# EAGLE design peripherals 1.0 (EAGLE 7.2.0)
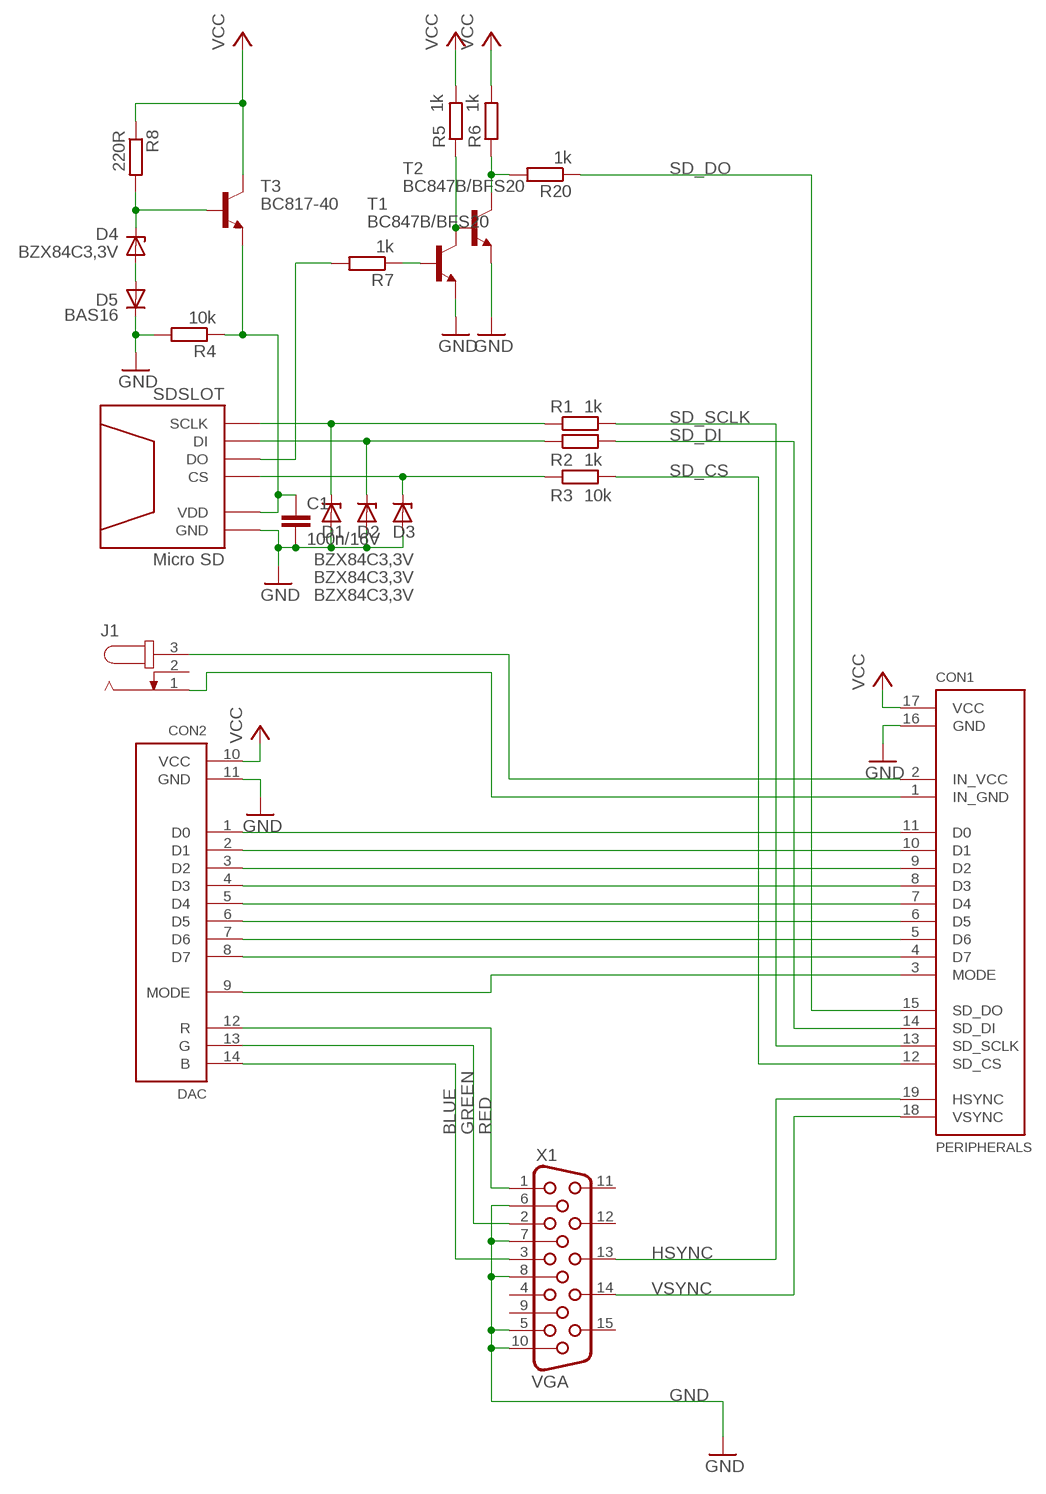
[diagram p0: schematic, sheet 1]

## Parts
C1  100n/16V  C-EUC0603  [C0603]
CON1  PERIPHERALS  [PERIPHERALS_CON]
CON2  DAC  [DAC_CON]
D1  BZX84C3,3V  ZENER-DIODESOT23  [SOT23]
D2  BZX84C3,3V  ZENER-DIODESOT23  [SOT23]
D3  BZX84C3,3V  ZENER-DIODESOT23  [SOT23]
D4  BZX84C3,3V  ZENER-DIODESOT23  [SOT23]
D5  BAS16  D-A1-C3  [SOT23]
J1  JACK-PLUG1  [SPC4078]
R1  1k  R-EU_0204/7  [0204/7]
R2  1k  R-EU_0204/7  [0204/7]
R3  10k  R-EU_0204/7  [0204/7]
R4  10k  R-EU_0204/7  [0204/7]
R5  1k  R-EU_0204/7  [0204/7]
R6  1k  R-EU_0204/7  [0204/7]
R7  1k  R-EU_0204/7  [0204/7]
R8  220R  R-EU_R0603  [R0603]
R20  1k  R-EU_0204/7  [0204/7]
SDSLOT  Micro SD  SD_SPI  [MICRO_SD_ATTEND]
T1  BC847B/BFS20  BC817-40-NPN-SOT23-BEC  [SOT23-BEC]
T2  BC847B/BFS20  BC817-40-NPN-SOT23-BEC  [SOT23-BEC]
T3  BC817-40  BC817-40-NPN-SOT23-BEC  [SOT23-BEC]
X1  VGA  HF15H  [HDF15H]

## Nets
BLUE: CON2.14(B) X1.3
GND: C1.2 CON1.16(GND) CON2.11(GND) D1.1(A) D2.1(A) D3.1(A) D5.3(C) R4.2 SDSLOT.6(GND) SDSLOT.CASE1(GND) SDSLOT.CASE2(GND) SDSLOT.CASE3(GND) SDSLOT.CASE4(GND) T1.E T2.E X1.5 X1.6 X1.7 X1.8 X1.10
GREEN: CON2.13(G) X1.2
HSYNC: CON1.19(HSYNC) X1.13
IN_GND: CON1.1(IN_GND) J1.1
IN_VCC: CON1.2(IN_VCC) J1.3
N$1: D1.3(C) R1.1 SDSLOT.5(SCLK)
N$2: D2.3(C) R2.1 SDSLOT.3(DI)
N$3: D3.3(C) R3.1 SDSLOT.2(CS)
N$4: D4.1(A) D5.1(A)
N$5: C1.1 R4.1 SDSLOT.4(VDD) T3.E
N$6: D4.3(C) R8.2 T3.B
N$7: R6.1 R20.2 T2.C
N$8: R7.2 SDSLOT.7(DO)
N$10: R5.1 T1.C T2.B
N$11: R7.1 T1.B
N$13: CON1.11(D0) CON2.1(D0)
N$14: CON1.10(D1) CON2.2(D1)
N$15: CON1.9(D2) CON2.3(D2)
N$16: CON1.8(D3) CON2.4(D3)
N$17: CON1.7(D4) CON2.5(D4)
N$18: CON1.6(D5) CON2.6(D5)
N$19: CON1.5(D6) CON2.7(D6)
N$20: CON1.4(D7) CON2.8(D7)
N$21: CON1.3(MODE) CON2.9(MODE)
RED: CON2.12(R) X1.1
SD_CS: CON1.12(SD_CS) R3.2
SD_DI: CON1.14(SD_DI) R2.2
SD_DO: CON1.15(SD_DO) R20.1
SD_SCLK: CON1.13(SD_SCLK) R1.2
VCC: CON1.17(VCC) CON2.10(VCC) R5.2 R6.2 R8.1 T3.C
VSYNC: CON1.18(VSYNC) X1.14
Unconnected: J1.2 X1.4 X1.9 X1.11 X1.12 X1.15

## Library data of the parts
C1 = rcl:C-EU: CAPACITOR, European symbol
CON1 = peripherals connector:PERIPHERALS
CON2 = DAC connector:DAC
D1-D4 = diode:ZENER-DIODE: Z-Diode
D5 = semicon-smd-ipc:D-: DIODE unfilled
J1 = con-jack:JACK-PLUG: DC POWER JACK Power Jack, DC, Right Angle, Through Hole, Rated 5A at 16VDC, PC Terminals Distributor: Farnell (www.Farnell.de) Drawing: 84N1161.pdf / 84N1162.pdf Manufacturer: SPC Technology (www.spctechnology.com) Type: SPC4077 / SPC 4078; OC_FARNELL: unknown; OC_NEWARK: unknown
R1-R8 R20 = rcl:R-EU_: RESISTOR, European symbol
SDSLOT = SD card:SD_SPI
T1-T3 = transistor:*-NPN-: NPN Transistror BF959 corrected 2008.03.06
X1 = con-subd:HF15: SUB-D; OC_FARNELL: unknown; OC_NEWARK: unknown

## Board
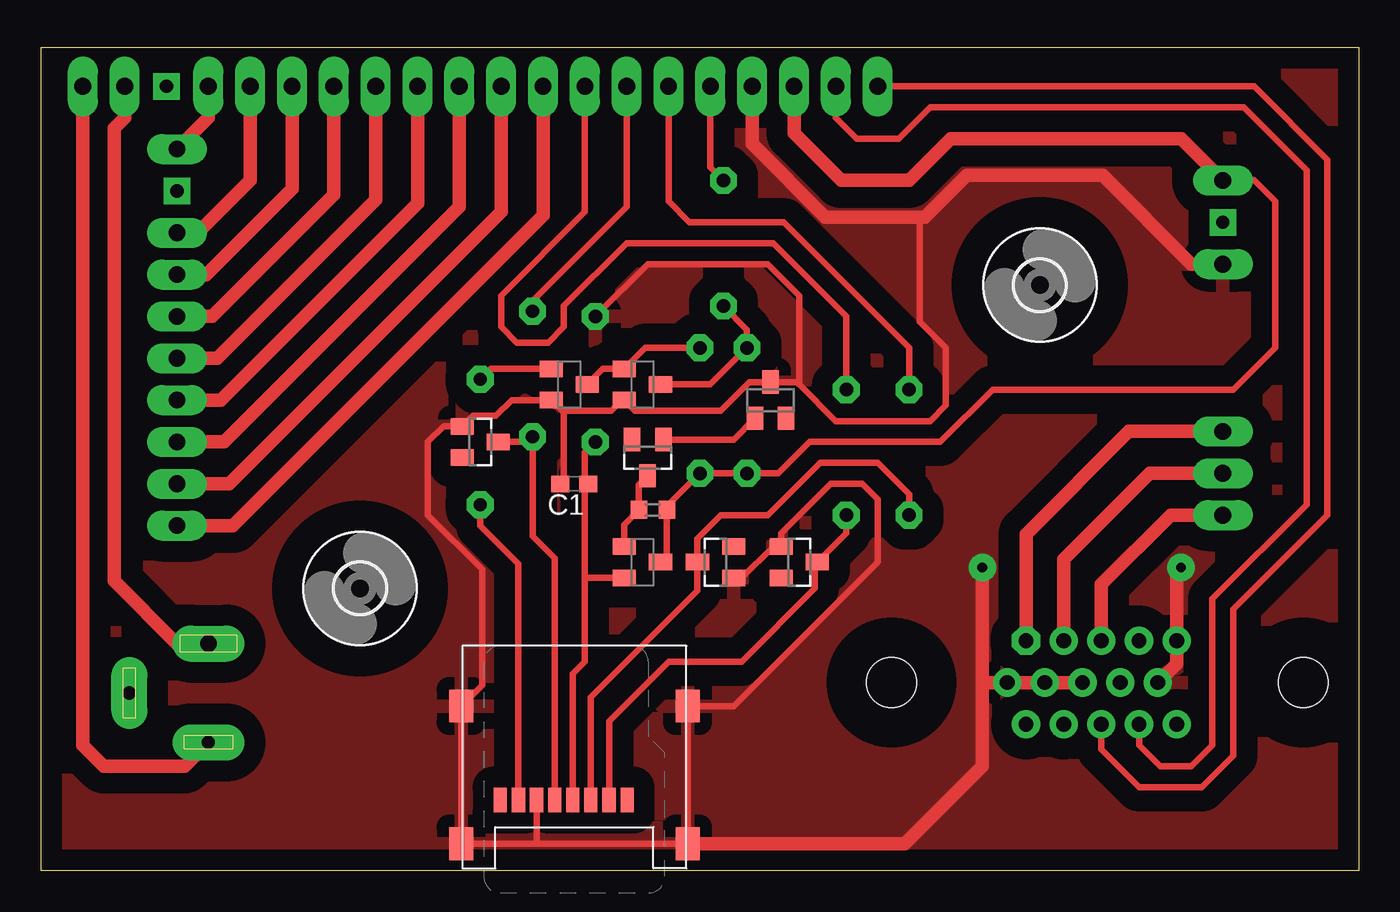
[diagram p1: board, top side]
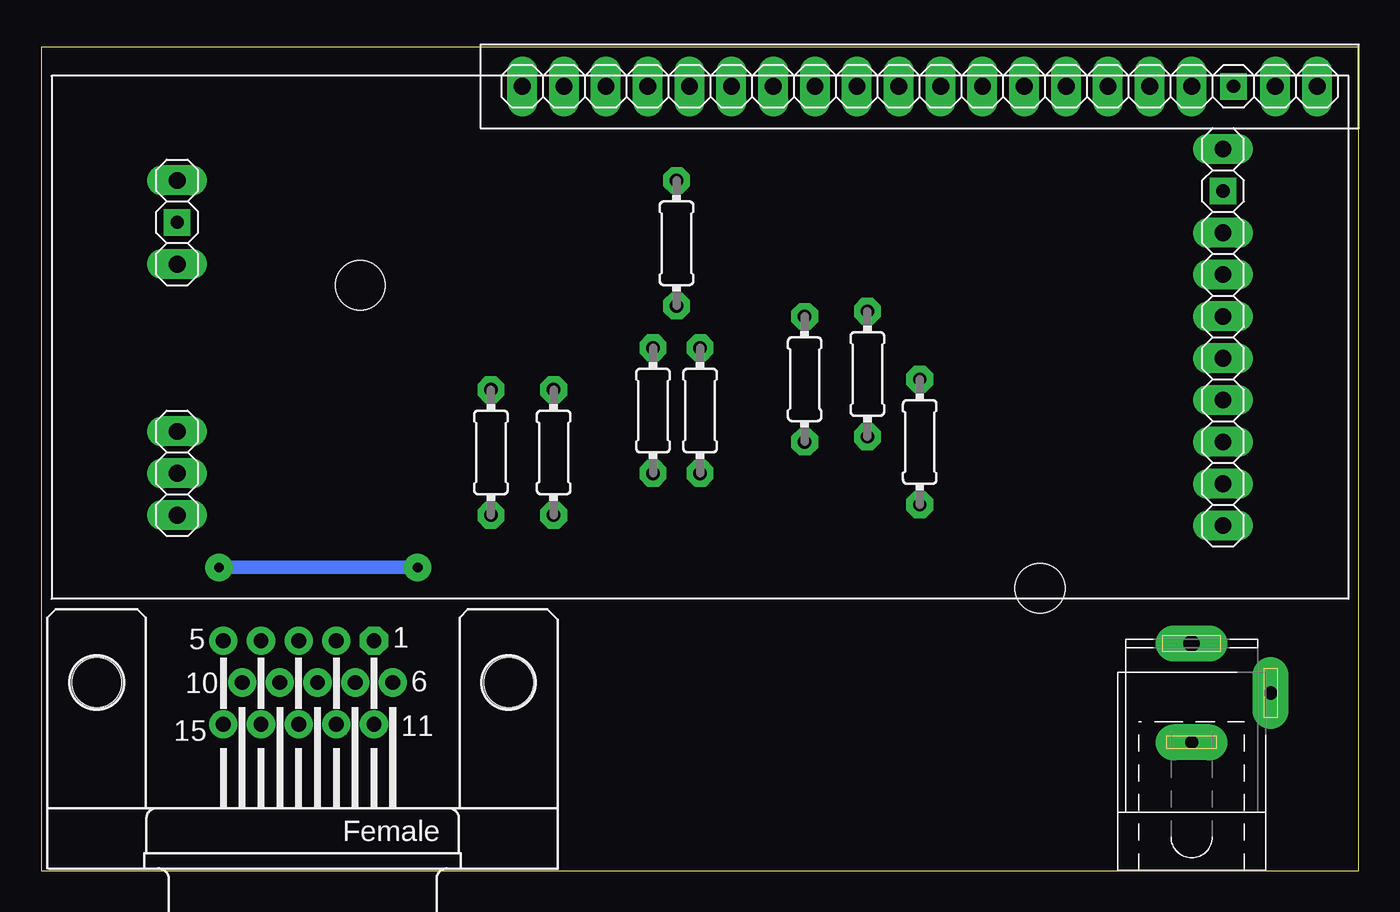
[diagram p2: board, bottom side, seen from below]

Size 80 x 50 mm. Coordinates in mm from the lower left corner, seen from the top.
Outline: 80,0 0,0 0,50 80,50 80,0
Copper layers (1*16): Top 0.035mm / dielectric 1.5mm / Bottom 0.035mm
Design rules "Aroidzap_DesignRules": minimum track width 16mil, minimum drill 0.6mm, track to track 20mil, track to pad 20mil, pad to pad 20mil, via to via 20mil, smd to smd 16mil, copper to edge 20mil, drill to drill 40mil, minimum pad ring 16mil, minimum via ring 10mil, stop-mask expansion 4mil, vias tented up to drill 0mil, thermal gap 30mil

### Footprints (pad centres in the part's own frame; a part is rotated, then mirrored left to right if it is on the bottom)
C0603 = smd 1.1 x 1: 1 -0.85,0; 2 0.85,0
PERIPHERALS_CON = drill 1.016 long: 1 24.13,0; 2 21.59,0; 3 16.51,0; 4 13.97,0; 5 11.43,0; 6 8.89,0; 7 6.35,0; 8 3.81,0; 9 1.27,0; 10 -1.27,0; 11 -3.81,0; 12 -6.35,0; 13 -8.89,0; 14 -11.43,0; 15 -13.97,0; 16 -16.51,0; 17 -19.05,0; 18 -21.59,0; 19 -24.13,0 | drill 0.8 square: NC 19.05,0
DAC_CON = drill 1.016 long: 1 31.75,-11.43; 2 31.75,-8.89; 3 31.75,-6.35; 4 31.75,-3.81; 5 31.75,-1.27; 6 31.75,1.27; 7 31.75,3.81; 8 31.75,6.35; 9 31.75,11.43; 10 -31.75,9.525; 11 -31.75,4.445; 12 -31.75,-5.715; 13 -31.75,-8.255; 14 -31.75,-10.795 | drill 0.8 square: NC1 31.75,8.89; NC2 -31.75,6.985
SOT23 = smd 1 x 1.4: 1 -0.95,-1.1; 2 0.95,-1.1; 3 0,1.1
SPC4078 = drill 0.8 pad 2.184 long: 1 -3,0; 2 0,-4.8 | drill 1 pad 2.184 long: 3 3,0
0204/7 = drill 0.813 octagon: 1 -3.81,0; 2 3.81,0
R0603 = smd 1 x 1.1: 1 -0.85,0; 2 0.85,0
MICRO_SD_ATTEND = smd 0.8 x 1.5: 1 -3.2,9.35; 2 -2.1,9.35; 3 -1,9.35; 4 0.1,9.35; 5 1.2,9.35; 6 2.3,9.35; 7 3.4,9.35; 8 4.5,9.35 | smd 1.45 x 2: CASE1 -6.875,12; CASE2 6.875,12; CASE3 -6.875,3.65; CASE4 6.875,3.65
SOT23-BEC = smd 1 x 1.4: B -0.95,-1.1; C 0,1.1; E 0.95,-1.1
3,0 = hole 3: 0,0
HDF15H = drill 0.9 octagon: 1 4.329,2.54 | drill 0.9: 2 2.043,2.54; 3 -0.243,2.54; 4 -2.529,2.54; 5 -4.815,2.54; 6 5.472,0; 7 3.186,0; 8 0.9,0; 9 -1.386,0; 10 -3.672,0; 11 4.329,-2.54; 12 2.043,-2.54; 13 -0.243,-2.54; 14 -2.529,-2.54; 15 -4.815,-2.54 | hole 3: -12.5,0; 12.5,0

### Placement (x,y rotation side)
C1  32.38,23.5 180 top
CON1  26.66,47.62 0 bottom
CON2  40,32.38 0 bottom
D1  26.66,26.04 270 top
D2  40.95,18.73 90 top
D3  46.03,18.73 270 top
D4  36.82,25.08 180 top
D5  44.28,28.57 0 top
J1  10.15,10.79 90 bottom
R1  29.83,30.16 90 bottom
R2  52.7,25.4 90 bottom
R3  48.89,25.4 90 bottom
R4  33.65,29.84 90 bottom
R5  40,27.94 270 bottom
R6  42.85,27.94 270 bottom
R7  26.66,26.04 270 bottom
R8  37.14,21.91 180 top
R20  41.42,38.1 270 bottom
SDSLOT  32.38,13.65 180 top
T1  32.06,29.53 270 top
T2  36.5,29.53 270 top
T3  36.5,18.73 270 top
U$1  [3,0]  19.36,17.14 0 top
U$2  [3,0]  60.63,35.56 0 top
X1  64.12,11.43 0 bottom

### Tracks (layer width: path | path; a pad name or v marks a point on that pad's centre or on a via)
BLUE
  Top 0.813: X1.3 64.37,17.39 68.57,21.59 CON2.14
GND  (via drill 0.6 pad 1.68)
  Top 0.406: 30.07,1.65 SDSLOT.CASE2 SDSLOT.CASE4 26.77,11.27 26.77,18.3 23.48,21.59 23.48,26.04 24.43,26.98 D1.1 26.2,27.62 27.61,27.62 28.57,28.58 T1.E 31.59,27.94 31.74,27.94 | 30.07,1.65 SDSLOT.CASE1 SDSLOT.CASE3 42.06,10 50.79,18.73 50.79,22.54 49.84,23.5 47.93,23.5 44.93,20.49 D3.1 | SDSLOT.6 30.07,1.65 | D2.1 42.54,17.78 44.44,19.68 D3.1 | D3.1 | T2.E 36.04,27.94 41.27,27.94 43,29.68 D5.3 45.88,29.68 46.03,29.53 | T2.E | T2.E 35.23,28.58 34.6,27.94 31.74,27.94 | R4.2 36.82,36.83 44.12,36.83 46.03,34.92 46.03,29.53 | 46.03,29.53 48.25,27.3 53.97,27.3 54.92,28.26 54.92,31.75 53.33,33.34 53.33,39.69 | C1.2 31.74,23.5 31.74,27.94
  Top 0.813: X1.8 X1.7 X1.6 57.14,11.43 | X1.10 68.94,12.57 X1.5 68.94,18.15 v69.2,18.41 | v57.14,18.41 57.14,11.43 | 57.14,11.43 57.14,6.35 52.44,1.65 SDSLOT.CASE1 | CON1.16 43.17,44.13 47.62,39.69 53.33,39.69 53.65,39.69 56.19,42.23 64.44,42.23 69.84,36.83 CON2.11
  Bottom 0.813: v57.14,18.41 v69.2,18.41
  pour Top (isolate 1.27): -0.01,0 80.32,0 80.32,50.16 -0.01,50.16
GREEN
  Top 0.813: X1.2 62.08,18.91 67.3,24.13 CON2.13
HSYNC
  Top 0.406: X1.13 64.37,7.38 66.66,5.08 70.47,5.08 72.38,6.99 72.38,15.88 78.09,21.59 78.09,43.18 73.65,47.62 CON1.19
IN_GND
  Top 0.813: J1.1 8.71,6.35 3.8,6.35 2.53,7.62 CON1.1
IN_VCC
  Top 0.813: CON1.2 5.07,45.72 4.44,45.09 4.44,17.61 8.25,13.79 J1.3
N$1
  Top 0.406: SDSLOT.5 31.17,18.98 29.83,20.32 29.83,26.04 | 29.83,26.04 R1.1 | D1.3 29.83,26.04
N$2
  Top 0.406: SDSLOT.3 33.38,10.53 39.85,17 D2.3 39.85,20.17 41.27,21.59 44.12,21.59 47.3,24.77 50.79,24.77 52.7,22.86 R2.1
N$3
  Top 0.406: SDSLOT.2 34.48,9.09 38.09,12.7 42.54,12.7 46.98,17.14 46.98,18.59 D3.3 48.89,20.49 R3.1
N$4
  Top 0.406: D4.1 42.04,26.18 D5.1
N$5
  Top 0.406: 33.01,17.78 33.01,12.7 32.27,11.96 SDSLOT.4 | T3.E 33.01,17.78 | R4.1 33.01,25.4 33.01,24.13 33.01,23.5 | 33.01,23.5 33.01,17.78 | C1.1 33.01,23.5
N$6
  Top 0.406: D4.3 36.29,23.45 R8.2 35.4,21.02 T3.B
N$7
  Top 0.406: T2.C 40.63,29.53 R6.1 42.85,32.86 R20.2
N$8
  Top 0.406: SDSLOT.7 28.97,18.64 26.66,20.95 R7.2
N$10
  Top 0.406: R5.1 36.68,31.75 T2.B 34.11,30.48 T1.C
N$11
  Top 0.406: T1.B 27.29,30.48 R7.1
N$13
  Top 0.813: CON1.11 30.47,39.79 11.64,20.95 CON2.1
N$14
  Top 0.813: CON2.2 11.42,23.5 27.93,40.01 CON1.10
N$15
  Top 0.813: CON2.3 11.12,26.04 25.39,40.3 CON1.9
N$16
  Top 0.813: CON2.4 10.91,28.57 22.85,40.52 CON1.8
N$17
  Top 0.813: CON2.5 10.7,31.11 20.31,40.73 CON1.7
N$18
  Top 0.813: CON2.6 10.38,33.66 17.77,41.04 CON1.6
N$19
  Top 0.813: CON2.7 10.02,36.2 15.23,41.41 CON1.5
N$20
  Top 0.813: CON2.8 9.52,38.73 12.69,41.91 CON1.4
N$21
  Top 0.813: CON2.9 10.15,45.72 CON1.3
RED
  Top 0.813: X1.1 59.8,20.44 66.03,26.67 CON2.12
SD_CS
  Top 0.406: CON1.12 33.01,40.01 27.93,34.92 27.93,33.02 28.88,32.07 30.79,32.07 31.74,33.02 31.74,34.29 35.55,38.1 44.44,38.1 48.89,33.66 R3.2
SD_DI
  Top 0.406: CON1.14 38.09,40.64 39.36,39.37 45.08,39.37 52.7,31.75 R2.2
SD_DO
  Top 0.406: CON1.15 40.63,42.7 R20.1
SD_SCLK
  Top 0.406: R1.2 29.83,34.61 35.55,40.32 CON1.13
VCC
  Top 0.406: T3.C 37.99,19.12 R8.1 37.99,22.12 R5.2 R6.2 44.76,24.13 46.66,26.04 54.6,26.04 57.77,29.21 72.38,29.21 74.92,31.75 74.92,40.64 73.65,41.91 CON2.10
  Top 0.813: CON1.17 45.71,44.77 48.57,41.91 52.7,41.91 55.23,44.45 69.2,44.45 CON2.10
VSYNC
  Top 0.406: X1.14 66.65,7.63 67.93,6.35 69.84,6.35 71.11,7.62 71.11,16.51 76.82,22.23 76.82,42.55 73.02,46.35 53.97,46.35 52.06,44.45 49.52,44.45 48.25,45.72 CON1.18